# Altium schematic sheet ADC.SchDoc
size A4
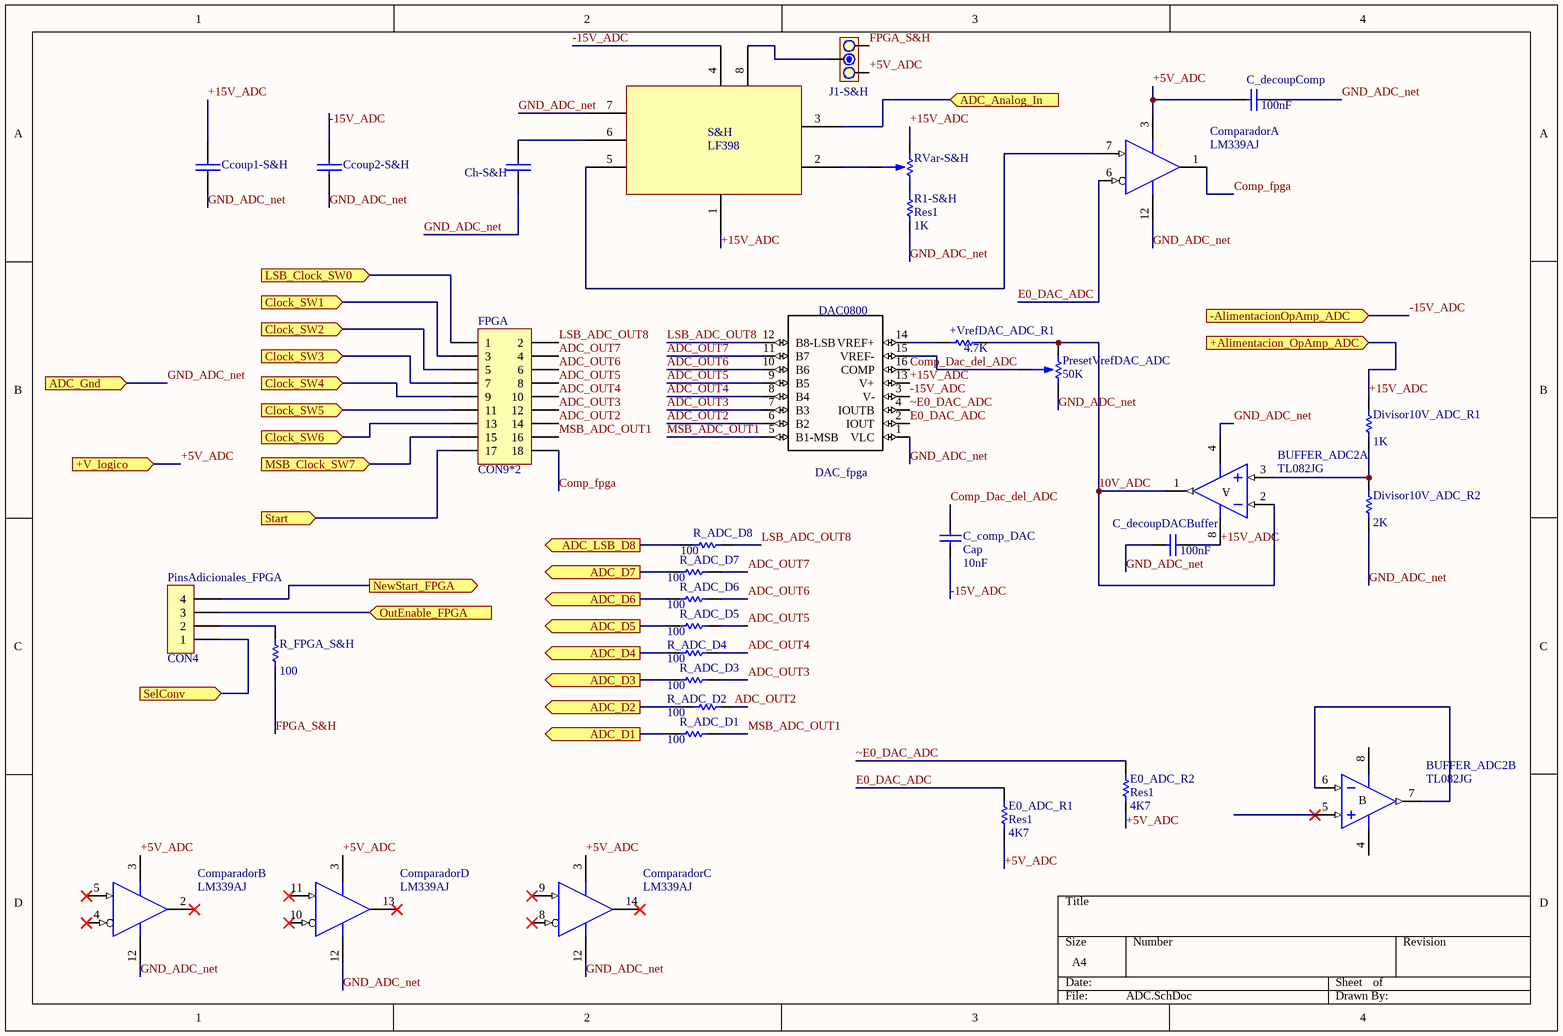
[diagram p0: ADC.SchDoc]

## Parts
+VrefDAC_ADC_R1  value 4.7K  [AXIAL-0.3]  (hidden comment: Res1)
BUFFER_ADC2  TL082JG  [JG008]  (parts A,B of 2)
C_comp_DAC  Cap  value 10nF  [RAD-0.3]
C_decoupComp  value 100nF  [RAD-0.3]  (hidden comment: Cap)
C_decoupDACBuffer  value 100nF  [RAD-0.3]  (hidden comment: Cap)
Ccoup1-S&H  CAP  [CAP200]  (value not drawn)
Ccoup2-S&H  CAP  [CAP200]  (value not drawn)
Ch-S&H  CAP  [CAP200]  (value not drawn)
Comparador  LM339AJ  [J014]  (parts A,B,C,D of 4)
DAC_fpga  DAC0800  [*DIL16]
Divisor10V_ADC_R1  value 1K  [AXIAL-0.3]  (hidden comment: Res1)
Divisor10V_ADC_R2  value 2K  [AXIAL-0.3]  (hidden comment: Res1)
E0_ADC_R1  Res1  value 4K7  [AXIAL-0.3]
E0_ADC_R2  Res1  value 4K7  [AXIAL-0.3]
FPGA  CON9*2  [SIP9*2]
J1-S&H  JUMPER  [JUMPER3]  (value not drawn)
PinsAdicionales_FPGA  CON4  [SIP4]
PresetVrefDAC_ADC  50K  [PRESET V]
R1-S&H  Res1  value 1K  [AXIAL-0.3]
R_ADC_D1  value 100  [AXIAL-0.3]  (hidden comment: Res1)
R_ADC_D2  value 100  [AXIAL-0.3]  (hidden comment: Res1)
R_ADC_D3  value 100  [AXIAL-0.3]  (hidden comment: Res1)
R_ADC_D4  value 100  [AXIAL-0.3]  (hidden comment: Res1)
R_ADC_D5  value 100  [AXIAL-0.3]  (hidden comment: Res1)
R_ADC_D6  value 100  [AXIAL-0.3]  (hidden comment: Res1)
R_ADC_D7  value 100  [AXIAL-0.3]  (hidden comment: Res1)
R_ADC_D8  value 100  [AXIAL-0.3]  (hidden comment: Res1)
R_FPGA_S&H  value 100  [AXIAL-0.3]  (hidden comment: Res1)
RVar-S&H  PRESET  [PRESET V]  (value not drawn)
S&H  LF398  [DIP8]

## Ports
+Alimentacion_OpAmp_ADC (in), +V_logico (in), -AlimentacionOpAmp_ADC (in), ADC_Analog_In (in), ADC_D1 (out), ADC_D2 (out), ADC_D3 (out), ADC_D4 (out), ADC_D5 (out), ADC_D6 (out), ADC_D7 (out), ADC_Gnd (in), ADC_LSB_D8 (out), Clock_SW1 (in), Clock_SW2 (in), Clock_SW3 (in), Clock_SW4 (in), Clock_SW5 (in), Clock_SW6 (in), LSB_Clock_SW0 (in), MSB_Clock_SW7 (in), NewStart_FPGA (out), OutEnable_FPGA (in), SelConv (in), Start (in)

## Nets
10V_ADC: +VrefDAC_ADC_R1.2 BUFFER_ADC2.1(OUT) BUFFER_ADC2.2(IN-) PresetVrefDAC_ADC.3
+5V_ADC: C_decoupComp.1 Comparador.3(VCC) E0_ADC_R1.1 E0_ADC_R2.1 J1-S&H.3 ; port +V_logico
+15V_ADC: BUFFER_ADC2.8(V+) C_decoupDACBuffer.2 Ccoup1-S&H.1 DAC_fpga.13(V+) Divisor10V_ADC_R1.2 RVar-S&H.3 S&H.1(GND) ; port +Alimentacion_OpAmp_ADC
-15V_ADC: C_comp_DAC.1 Ccoup2-S&H.1 DAC_fpga.3(V-) S&H.4(RESET) ; port -AlimentacionOpAmp_ADC
ADC_Analog_In: S&H.3(OUT) ; port ADC_Analog_In
ADC_D1: R_ADC_D1.1 ; port ADC_D1
ADC_D2: R_ADC_D2.1 ; port ADC_D2
ADC_D3: R_ADC_D3.1 ; port ADC_D3
ADC_D4: R_ADC_D4.1 ; port ADC_D4
ADC_D5: R_ADC_D5.1 ; port ADC_D5
ADC_D6: R_ADC_D6.1 ; port ADC_D6
ADC_D7: R_ADC_D7.1 ; port ADC_D7
ADC_LSB_D8: R_ADC_D8.1 ; port ADC_LSB_D8
ADC_OUT2: DAC_fpga.6(B2) FPGA.14 R_ADC_D2.2
ADC_OUT3: DAC_fpga.7(B3) FPGA.12 R_ADC_D3.2
ADC_OUT4: DAC_fpga.8(B4) FPGA.10 R_ADC_D4.2
ADC_OUT5: DAC_fpga.9(B5) FPGA.8 R_ADC_D5.2
ADC_OUT6: DAC_fpga.10(B6) FPGA.6 R_ADC_D6.2
ADC_OUT7: DAC_fpga.11(B7) FPGA.4 R_ADC_D7.2
Clock_SW1: FPGA.3 ; port Clock_SW1
Clock_SW2: FPGA.5 ; port Clock_SW2
Clock_SW3: FPGA.7 ; port Clock_SW3
Clock_SW4: FPGA.9 ; port Clock_SW4
Clock_SW5: FPGA.11 ; port Clock_SW5
Clock_SW6: FPGA.13 ; port Clock_SW6
Comp_Dac_del_ADC: C_comp_DAC.2 DAC_fpga.16(COMP)
Comp_fpga: Comparador.1(OUT) FPGA.18
E0_DAC_ADC: Comparador.6(IN-) DAC_fpga.2(IOUT) E0_ADC_R1.2
FPGA_S&H: J1-S&H.1 R_FPGA_S&H.1
GND_ADC_net: BUFFER_ADC2.4(V-) C_decoupComp.2 C_decoupDACBuffer.1 Ccoup1-S&H.2 Ccoup2-S&H.2 Ch-S&H.2 Comparador.12(GND) DAC_fpga.1(VLC) Divisor10V_ADC_R2.1 PresetVrefDAC_ADC.1 R1-S&H.1 S&H.7(DISCHARGE) ; port ADC_Gnd
LSB_ADC_OUT8: DAC_fpga.12(B8-LSB) FPGA.2 R_ADC_D8.2
LSB_Clock_SW0: FPGA.1 ; port LSB_Clock_SW0
MSB_ADC_OUT1: DAC_fpga.5(B1-MSB) FPGA.16 R_ADC_D1.2
MSB_Clock_SW7: FPGA.15 ; port MSB_Clock_SW7
NewStart_FPGA: PinsAdicionales_FPGA.4 ; port NewStart_FPGA
OutEnable_FPGA: PinsAdicionales_FPGA.3 ; port OutEnable_FPGA
SelConv: PinsAdicionales_FPGA.1 ; port SelConv
Start: FPGA.17 ; port Start
~E0_DAC_ADC: DAC_fpga.4(IOUTB) E0_ADC_R2.2
Net+VrefDAC_ADC_R1_1: +VrefDAC_ADC_R1.1 DAC_fpga.14(VREF+)
NetBUFFER_ADC2_3: BUFFER_ADC2.3(IN+) Divisor10V_ADC_R1.1 Divisor10V_ADC_R2.2
NetBUFFER_ADC2_6: BUFFER_ADC2.6(IN-) BUFFER_ADC2.7(OUT)
NetCh-S&H_1: Ch-S&H.1 S&H.6(THRESHOLD)
NetComparador_7: Comparador.7(IN+) S&H.5(C_VOLTAJE)
NetDAC_fpga_15: DAC_fpga.15(VREF-) PresetVrefDAC_ADC.2
NetJ1-S&H_2: J1-S&H.2 S&H.8(VCC)
NetPinsAdicionales_FPGA_2: PinsAdicionales_FPGA.2 R_FPGA_S&H.2
NetR1-S&H_2: R1-S&H.2 RVar-S&H.1
NetRVar-S&H_2: RVar-S&H.2 S&H.2(TRIGGER)

Not connected (* = marked no-connect by the designer): BUFFER_ADC2 5(IN+)*; Comparador 2(OUT)* 4(IN-)* 5(IN+)* 8(IN-)* 9(IN+)* 10(IN-)* 11(IN+)* 13(OUT)* 14(OUT)*

## Notes on the sheet
- (in symbol TL082JG, part A) A
- (in symbol TL082JG, part B) B

## Library data of the parts
+VrefDAC_ADC_R1 Divisor10V_ADC_R1 Divisor10V_ADC_R2 E0_ADC_R1 E0_ADC_R2 R1-S&H R_ADC_D1-R_ADC_D8 R_FPGA_S&H = Res1: Resistor; Published: 8-Jun-2000; LatestRevisionDate: 17-Jul-2002; LatestRevisionNote: Re-released for DXP Platform.; PackageReference: AXIAL-0.3; Publisher: Altium Limited; PackageDescription: Axial Device, Thru-Hole; 2 Leads; 0.3 in Pin Spacing
BUFFER_ADC2 = TL082JG: JFET-Input Operational Amplifier; Published: 16-Jan-2001; LatestRevisionDate: 04-Mar-2005; LatestRevisionNote: Stylized 3D Model Added.; DatasheetVersion: Feb-1999; PackageVersion: Jan-1995; PackageReference: JG008; Publisher: Altium Limited; PackageDescription: DIP; 8 Leads; Row Spacing 7.62 mm; Pitch 2.54 mm; ComponentLink1Description: Manufacturer Link; ComponentLink1URL: http://www.ti.com/; ComponentLink2Description: Datasheet; ComponentLink2URL: http://www-s.ti.com/sc/ds/tl082.pdf
C_comp_DAC C_decoupComp C_decoupDACBuffer = Cap: Capacitor; Published: 8-Jun-2000; LatestRevisionDate: 17-Jul-2002; LatestRevisionNote: Re-released for DXP Platform.; PackageReference: RAD-0.3; Publisher: Altium Limited; PackageDescription: Radial Cap, Thru-Hole; 2 Leads; 0.3 in Pin Spacing
Comparador = LM339AJ: Quad Differential Comparator; Published: 15-Apr-2002; LatestRevisionDate: 04-Mar-2005; LatestRevisionNote: Stylized 3D Model Added.; DatasheetVersion: Apr-1988; PackageVersion: Jun-1999; PackageReference: J014; Publisher: Altium Limited; PackageDescription: DIP; 14 Leads; Row Spacing 7.62 mm; Pitch 2.54 mm; ComponentLink1Description: Manufacturer Link; ComponentLink1URL: http://www.ti.com/; ComponentLink2Description: Datasheet; ComponentLink2URL: http://www-s.ti.com/sc/ds/lm139a.pdf
DAC_fpga = DAC0800: MF: Texas Instruments; SnapEDA_Link: https://www.snapeda.com/parts/DAC0800/Texas%20Instruments/view-part/?ref=snap; MP: DAC0800; Package: SOIC-16 Texas Instruments; Digi-Key_Part_Number: DAC0800LCN/NOPB-ND; Digi-Key_Purchase_URL: https://www.digikey.com.ar/product-detail/en/texas-instruments/DAC0800LCN-NOPB/DAC0800LCN-NOPB-ND/4652?utm_source=snapeda&utm_medium=aggregator&utm_campaign=symbol; Value: *
J1-S&H = JUMPER3
PresetVrefDAC_ADC = PRESET
S&H = LM555: Sample and Hold Amplifier